# Altium project DSO_Template.PrjPCB
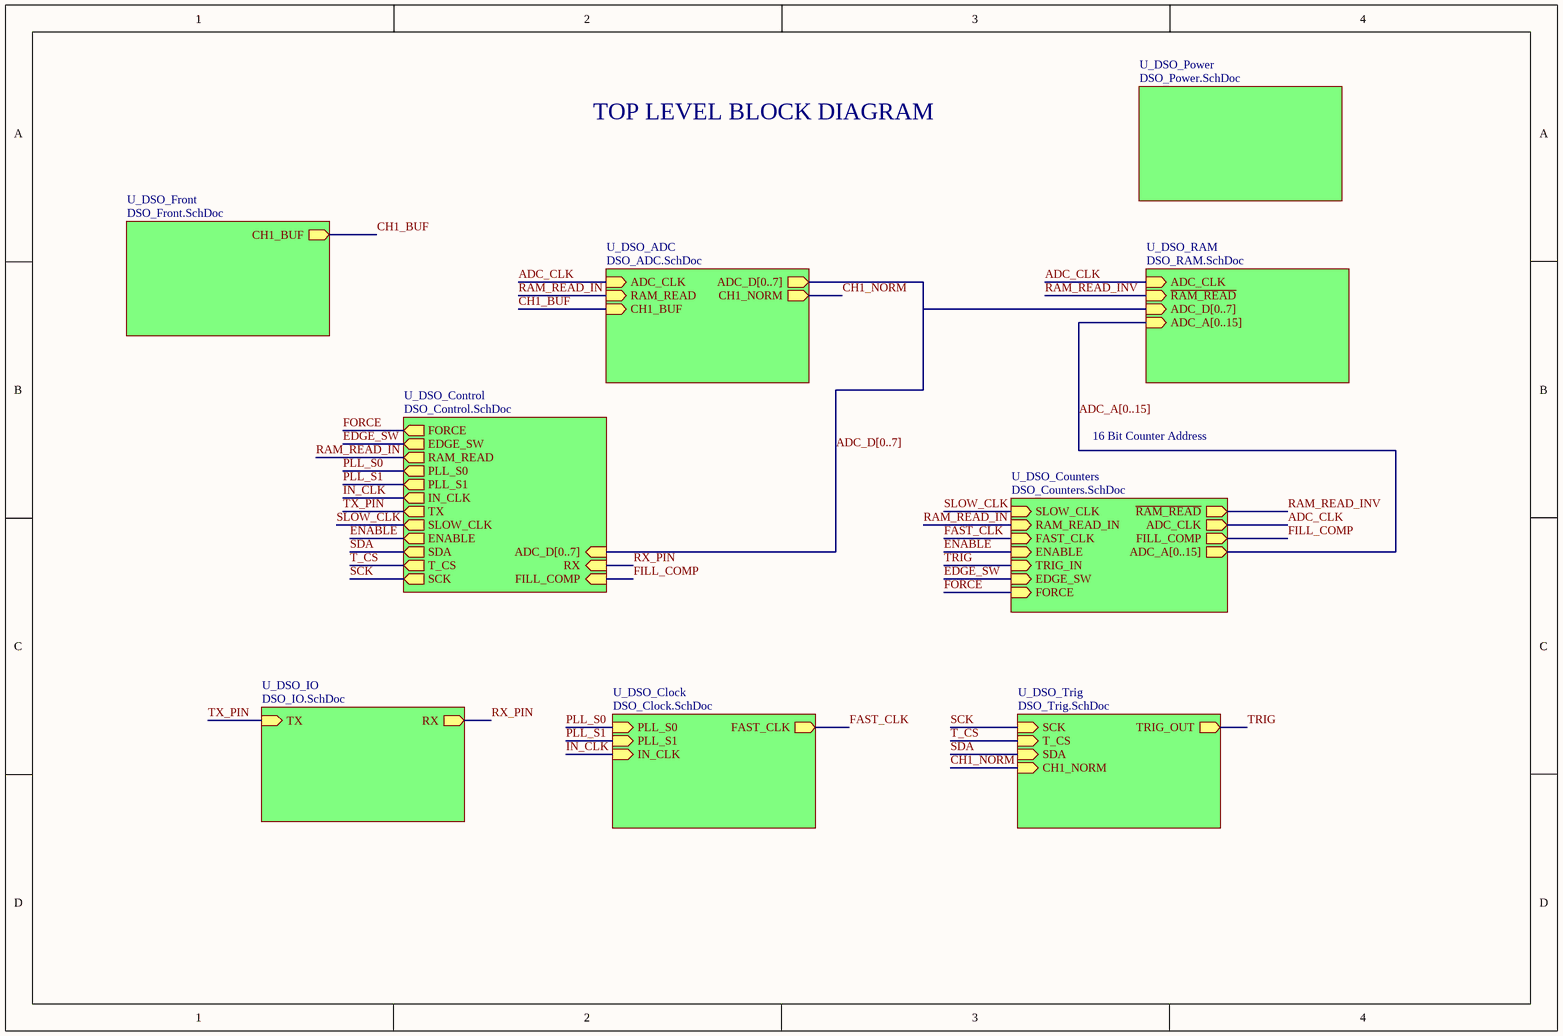
[diagram p0: DSO_Top.SchDoc]
11 sheets, 144 parts. Net scope: hierarchical (ports join the sheet entries above them; power ports are global).
Board file: DSO.PcbDoc
Sheets:
  DSO_Top.SchDoc
    U_DSO_ADC = DSO_ADC.SchDoc
    U_DSO_Clock = DSO_Clock.SchDoc
    U_DSO_Control = DSO_Control.SchDoc
    U_DSO_Counters = DSO_Counters.SchDoc
      U_DSO_CPLD = DSO_CPLD.SchDoc
    U_DSO_Front = DSO_Front.SchDoc
    U_DSO_IO = DSO_IO.SchDoc
    U_DSO_RAM = DSO_RAM.SchDoc
    U_DSO_Trig = DSO_Trig.SchDoc
    U_DSO_Power = DSO_Power.SchDoc

## Sheet DSO_Top.SchDoc: Schematic_Name
size A4; CompanyName: University of Melbourne; Engineer: Your Name Here; DocumentNumber: 1; Revision: 0.1; SheetNumber: 1; SheetTotal: 1; Title_Project: Project_Title; StudentNo: Student No.

### Sub-sheets
U_DSO_ADC = DSO_ADC.SchDoc: ADC_CLK (in), ADC_D[0..7] (out), RAM_READ (in), CH1_BUF (in), CH1_NORM (out)
U_DSO_Clock = DSO_Clock.SchDoc: FAST_CLK (out), PLL_S0 (in), PLL_S1 (in), IN_CLK (in)
U_DSO_Control = DSO_Control.SchDoc: SCK (out), T_CS (out), SDA (out), ENABLE (out), FILL_COMP (in), SLOW_CLK (out), TX (out), RX (in), IN_CLK (out), PLL_S1 (out), PLL_S0 (out), RAM_READ (out), ADC_D[0..7] (in), EDGE_SW (out), FORCE (out)
U_DSO_Counters = DSO_Counters.SchDoc: SLOW_CLK (in), ~{RAM_READ} (out), ADC_CLK (out), RAM_READ_IN (in), FAST_CLK (in), FILL_COMP (out), ENABLE (in), TRIG_IN (in), EDGE_SW (in), FORCE (in), ADC_A[0..15] (out)
U_DSO_Front = DSO_Front.SchDoc: CH1_BUF (out)
U_DSO_IO = DSO_IO.SchDoc: TX (in), RX (out)
U_DSO_Power = DSO_Power.SchDoc: no entries
U_DSO_RAM = DSO_RAM.SchDoc: ADC_CLK (in), ~{RAM_READ} (in), ADC_D[0..7] (in), ADC_A[0..15] (in)
U_DSO_Trig = DSO_Trig.SchDoc: TRIG_OUT (out), SCK (in), T_CS (in), SDA (in), CH1_NORM (in)

### Nets
ADC_CLK: sheet U_DSO_ADC/ADC_CLK, sheet U_DSO_Counters/ADC_CLK, sheet U_DSO_RAM/ADC_CLK
CH1_BUF: sheet U_DSO_ADC/CH1_BUF, sheet U_DSO_Front/CH1_BUF  [project net AA_IN]
CH1_NORM: sheet U_DSO_ADC/CH1_NORM, sheet U_DSO_Trig/CH1_NORM
EDGE_SW: sheet U_DSO_Control/EDGE_SW, sheet U_DSO_Counters/EDGE_SW
ENABLE: sheet U_DSO_Control/ENABLE, sheet U_DSO_Counters/ENABLE
FAST_CLK: sheet U_DSO_Clock/FAST_CLK, sheet U_DSO_Counters/FAST_CLK
FILL_COMP: sheet U_DSO_Control/FILL_COMP, sheet U_DSO_Counters/FILL_COMP
FORCE: sheet U_DSO_Control/FORCE, sheet U_DSO_Counters/FORCE
IN_CLK: sheet U_DSO_Clock/IN_CLK, sheet U_DSO_Control/IN_CLK
PLL_S0: sheet U_DSO_Clock/PLL_S0, sheet U_DSO_Control/PLL_S0
PLL_S1: sheet U_DSO_Clock/PLL_S1, sheet U_DSO_Control/PLL_S1
RAM_READ_IN: sheet U_DSO_ADC/RAM_READ, sheet U_DSO_Control/RAM_READ, sheet U_DSO_Counters/RAM_READ_IN  [project net RAM_READ]
RAM_READ_INV: sheet U_DSO_Counters/~{RAM_READ}, sheet U_DSO_RAM/~{RAM_READ}  [project net ~{RAM_READ}]
RX_PIN: sheet U_DSO_Control/RX, sheet U_DSO_IO/RX  [project net RX]
SCK: sheet U_DSO_Control/SCK, sheet U_DSO_Trig/SCK
SDA: sheet U_DSO_Control/SDA, sheet U_DSO_Trig/SDA
SLOW_CLK: sheet U_DSO_Control/SLOW_CLK, sheet U_DSO_Counters/SLOW_CLK
T_CS: sheet U_DSO_Control/T_CS, sheet U_DSO_Trig/T_CS
TRIG: sheet U_DSO_Counters/TRIG_IN, sheet U_DSO_Trig/TRIG_OUT
TX_PIN: sheet U_DSO_Control/TX, sheet U_DSO_IO/TX  [project net TX]

### Buses and harness runs
bus ADC_A[0..15] = sheet U_DSO_Counters/ADC_A[0..15] = sheet U_DSO_RAM/ADC_A[0..15]
bus ADC_D[0..7] = sheet U_DSO_ADC/ADC_D[0..7] = sheet U_DSO_Control/ADC_D[0..7] = sheet U_DSO_RAM/ADC_D[0..7]

### Notes on the sheet
- TOP LEVEL BLOCK DIAGRAM
- 16 Bit Counter Address

## Sheet DSO_ADC.SchDoc: Schematic_Name
size A4; CompanyName: University of Melbourne; Engineer: Your Name Here; DocumentNumber: 1; Revision: 0.1; SheetNumber: 1; SheetTotal: 1; Title_Project: Project_Title; StudentNo: Student No.
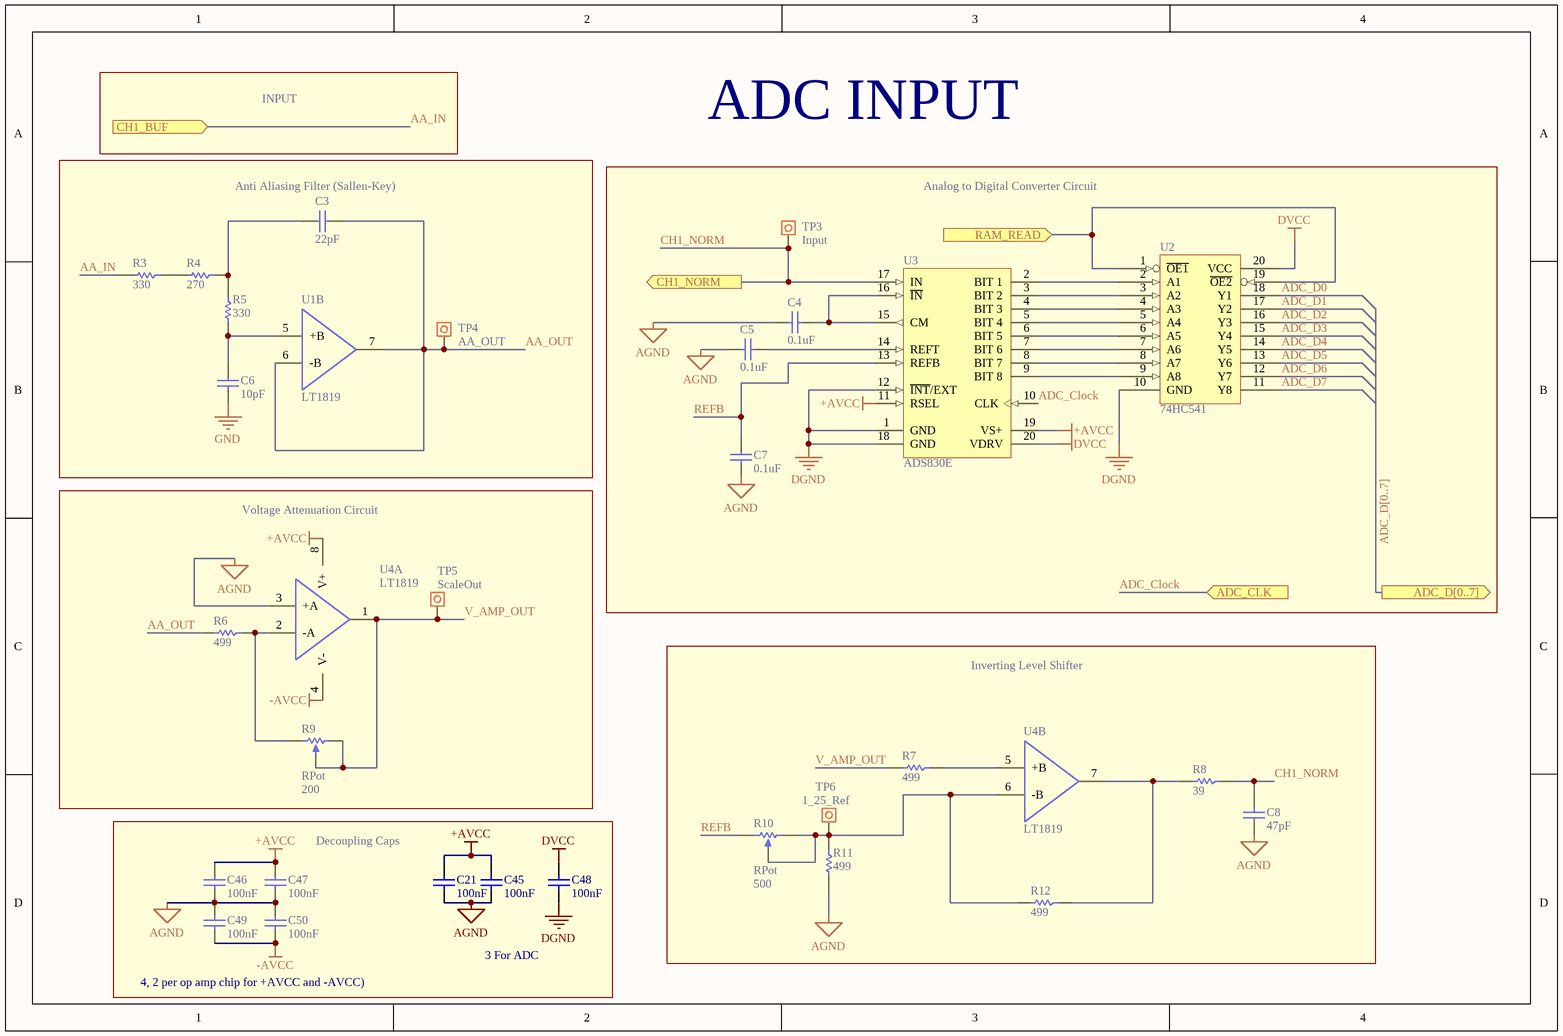
[diagram p1: DSO_ADC.SchDoc]

### Parts
C3  22pF  [0805C]
C4  0.1uF  [0805C]
C5  0.1uF  [0805C]
C6  10pF  [0805C]
C7  0.1uF  [0805C]
C8  47pF  [0805C]
C21  100nF  [0805C]
C45  100nF  [0805C]
C46  100nF  [0805C]
C47  100nF  [0805C]
C48  100nF  [0805C]
C49  100nF  [0805C]
C50  100nF  [0805C]
R3  330  [0805]
R4  270  [0805]
R5  330  [0805]
R6  499  [0805]
R7  499  [0805]
R8  39  [0805]
R9  RPot  value 200  [VR5]
R10  RPot  value 500  [VR5]
R11  499  [0805]
R12  499  [0805]
TP3  INPUT  [Testpoin]
TP4  value AA_OUT  [Testpoin]  (hidden comment: INPUT)
TP5  value ScaleOut  [Testpoin]  (hidden comment: INPUT)
TP6  value 1_25_Ref  [Testpoin]  (hidden comment: INPUT)
U1  LT1819  [SOIC-8]  (part B of 2)
U2  74HC541  [SOT163-1_N]
U3  ADS830E  [TI-DBQ20_L]
U4  LT1819  [SOIC-8]  (parts A,B of 2)

### Blocks framed on the sheet
Anti Aliasing Filter (Sallen-Key): C3 C6 R3-R5 TP4 U1
Analog to Digital Converter Circuit: C4 C5 C7 TP3 U2 U3
Voltage Attenuation Circuit: R6 R9 TP5 U4
Inverting Level Shifter: C8 R7 R8 R10-R12 TP6 U4

### Ports
ADC_CLK (in), ADC_D[0..7] (out), CH1_BUF (in), CH1_NORM (out), RAM_READ (in)

### Nets
+AVCC: C21.1 C45.1 C46.1 C47.1 U3.11(RSEL) U3.19(VS+) U4.8(V+)
-AVCC: C49.1 C50.1 U4.4(V-)
AGND: C4.1 C5.1 C7.1 C8.2 C21.2 C45.2 C46.2 C47.2 C49.2 C50.2 R11.2 U4.3(+A)
DGND: C48.2 U2.10(GND) U3.1(GND) U3.12(~{INT}/EXT) U3.18(GND)
DVCC: C48.1 U2.20(VCC) U3.20(VDRV)
GND: C6.2
AA_IN: R3.2 ; port CH1_BUF
AA_OUT: C3.1 R6.2 TP4.1 U1.6(-B) U1.7(OUTB)
ADC_Clock: U3.10(CLK) ; port ADC_CLK  [project net ADC_CLK]
ADC_D0: U2.18(Y1)
ADC_D1: U2.17(Y2)
ADC_D2: U2.16(Y3)
ADC_D3: U2.15(Y4)
ADC_D4: U2.14(Y5)
ADC_D5: U2.13(Y6)
ADC_D6: U2.12(Y7)
ADC_D7: U2.11(Y8)
CH1_NORM: C8.1 R8.1 TP3.1 U3.17(IN) ; port CH1_NORM
RAM_READ: U2.1(~{OE1}) U2.19(~{OE2}) ; port RAM_READ
REFB: C7.2 R10.1(TOP) U3.13(REFB)
V_AMP_OUT: R7.2 R9.2(TAP) R9.3(BOT) TP5.1 U4.1(OUTA)
NetC3_2: C3.2 R4.1 R5.1
NetC4_2: C4.2 U3.15(CM) U3.16(~{IN})
NetC5_2: C5.2 U3.14(REFT)
NetC6_1: C6.1 R5.2 U1.5(+B)
NetR3_1: R3.1 R4.2
NetR6_1: R6.1 R9.1(TOP) U4.2(-A)
NetR7_1: R7.1 U4.5(+B)
NetR8_2: R8.2 R12.1 U4.7(OUTB)
NetR10_2: R10.2(TAP) R10.3(BOT) R11.1 R12.2 TP6.1 U4.6(-B)
NetU2_2: U2.2(A1) U3.2(BIT_1)
NetU2_3: U2.3(A2) U3.3(BIT_2)
NetU2_4: U2.4(A3) U3.4(BIT_3)
NetU2_5: U2.5(A4) U3.5(BIT_4)
NetU2_6: U2.6(A5) U3.6(BIT_5)
NetU2_7: U2.7(A6) U3.7(BIT_6)
NetU2_8: U2.8(A7) U3.8(BIT_7)
NetU2_9: U2.9(A8) U3.9(BIT_8)

### Buses and harness runs
bus ADC_D[0..7] = port ADC_D[0..7]

### Notes on the sheet
- INPUT
- ADC INPUT
- Decoupling Caps
- 4, 2 per op amp chip for +AVCC and -AVCC)
- 3 For ADC

### Library data of the parts
C3-C8 C21 C45-C50 = C: Capacitor; Reviewed by: RM - 2018/08/05; Revision: July-2002: Re-released for DXP Platform.; Supplier 1: *; Supplier Part Number 1: *
  C3: Value: 22pF
  C4 C5 C7: Value: 0.1uF
  C6: Value: 10pF
  C8: Value: 47pF
  C21 C45-C50: Value: 100nF
R3-R8 R11 R12 = R: Resistor; Reviewed by: RM - 2018/08/05; Supplier 1: *; Suppler Part Number 1: *
  R3 R5: Value: 330
  R4: Value: 270
  R6 R7 R11 R12: Value: 499
  R8: Value: 39
R9 R10 = RPot: Potentiometer; Sim Note: Enter the Resistance value and the set point into parameter fields.; Set Position: 0.5; Published: 8-Jun-2000; LatestRevisionDate: 17-Jul-2002; LatestRevisionNote: Re-released for DXP Platform.; PackageReference: VR5; Publisher: Altium Limited; PackageDescription: Variable Resistor, Thru-Hole; 3 Leads
TP3-TP6 = Test Point: Pad
  TP3: Value: Input
U1 U4 = LT1819: OpAmp High Frequency Dual; Reviewed by: RM - 2018/08/05; Supplier 1: Digi-Key; Supplier Part Number 1: LT1819CMS8#PBF-ND
U2 = 74HC541: (ADV) Octal Buffer, Line Driver; Reviewed by: RM - 2018/08/05; Supplier 1: Digi-Key; Supplier Part Number 1: 296-1202-1-ND
U3 = ADS830E: 8-Bit, 60 MSPS ADC Single-Ended / Differential Input, Internal / External Reference and Programmble Input Range, -40 to 85 degC, 20-pin SOP (DBQ20), Green (RoHS & no Sb/Br); Reviewed by: RM - 2018/08/05; ComponentLink2URL: http://www.ti.com/general/docs/lit/getliterature.tsp?genericPartNumber=ADS830&fileType=pdf; ComponentLink2Description: Datasheet; ComponentLink1URL: http://www.ti.com/; ComponentLink3URL: http://www.ti.com/litv/pdf/mpds210a; ComponentLink3Description: Package Specification; ComponentLink1Description: Manufacturer URL; Supplier 1: Digi-Key; Supplier Part Number 1: ADS830E-ND

## Sheet DSO_Clock.SchDoc: Schematic_Name
size A4; CompanyName: University of Melbourne; Engineer: Your Name Here; DocumentNumber: 1; Revision: 0.1; SheetNumber: 1; SheetTotal: 1; Title_Project: Project_Title; StudentNo: Student No.
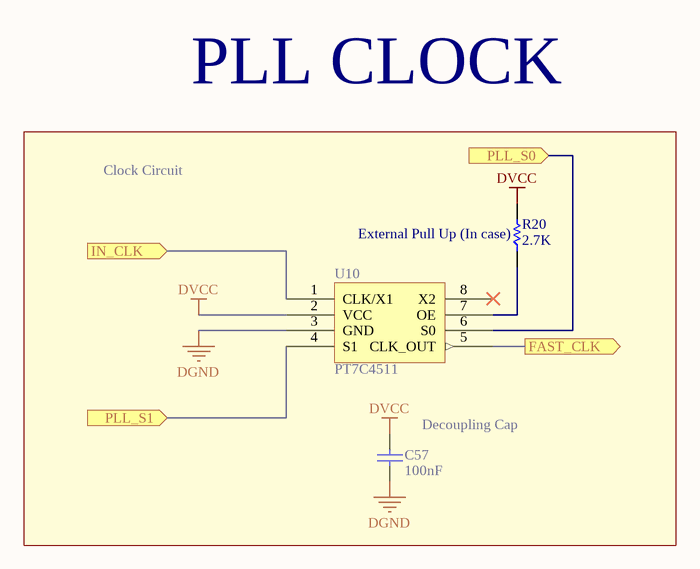
[diagram p2: DSO_Clock.SchDoc]

### Parts
C57  100nF  [0805C]
R20  2.7K  [0805]
U10  PT7C4511  [SOIC-8]

### Ports
FAST_CLK (out), IN_CLK (in), PLL_S0 (in), PLL_S1 (in)

### Nets
DGND: C57.2 U10.3(GND)
DVCC: C57.1 R20.2 U10.2(VCC)
FAST_CLK: U10.5(CLK_OUT) ; port FAST_CLK
IN_CLK: U10.1(CLK/X1) ; port IN_CLK
PLL_S0: U10.6(S0) ; port PLL_S0
PLL_S1: U10.4(S1) ; port PLL_S1
NetR20_1: R20.1 U10.7(OE)

Not connected (* = marked no-connect by the designer): U10 8(X2)*

### Notes on the sheet
- PLL CLOCK
- Clock Circuit
- (near R20) External Pull Up (In case)
- (near C57) Decoupling Cap

### Library data of the parts
C57 = C: Capacitor; Reviewed by: RM - 2018/08/05; Revision: July-2002: Re-released for DXP Platform.; Supplier 1: *; Supplier Part Number 1: *; Value: 100nF
R20 = R: Resistor; Reviewed by: RM - 2018/08/05; Supplier 1: *; Suppler Part Number 1: *; Value: 2.7K
U10 = PT7C4511: PLL Clock Multiplier; Reviewed by: RM - 2018/08/05; Supplier 1: Digi-Key; Supplier Part Number 1: PT7C4511WEXDICT-ND

## Sheet DSO_Control.SchDoc: Schematic_Name
size A4; CompanyName: University of Melbourne; Engineer: Your Name Here; DocumentNumber: 1; Revision: 0.1; SheetNumber: 1; SheetTotal: 1; Title_Project: Project_Title; StudentNo: Student No.
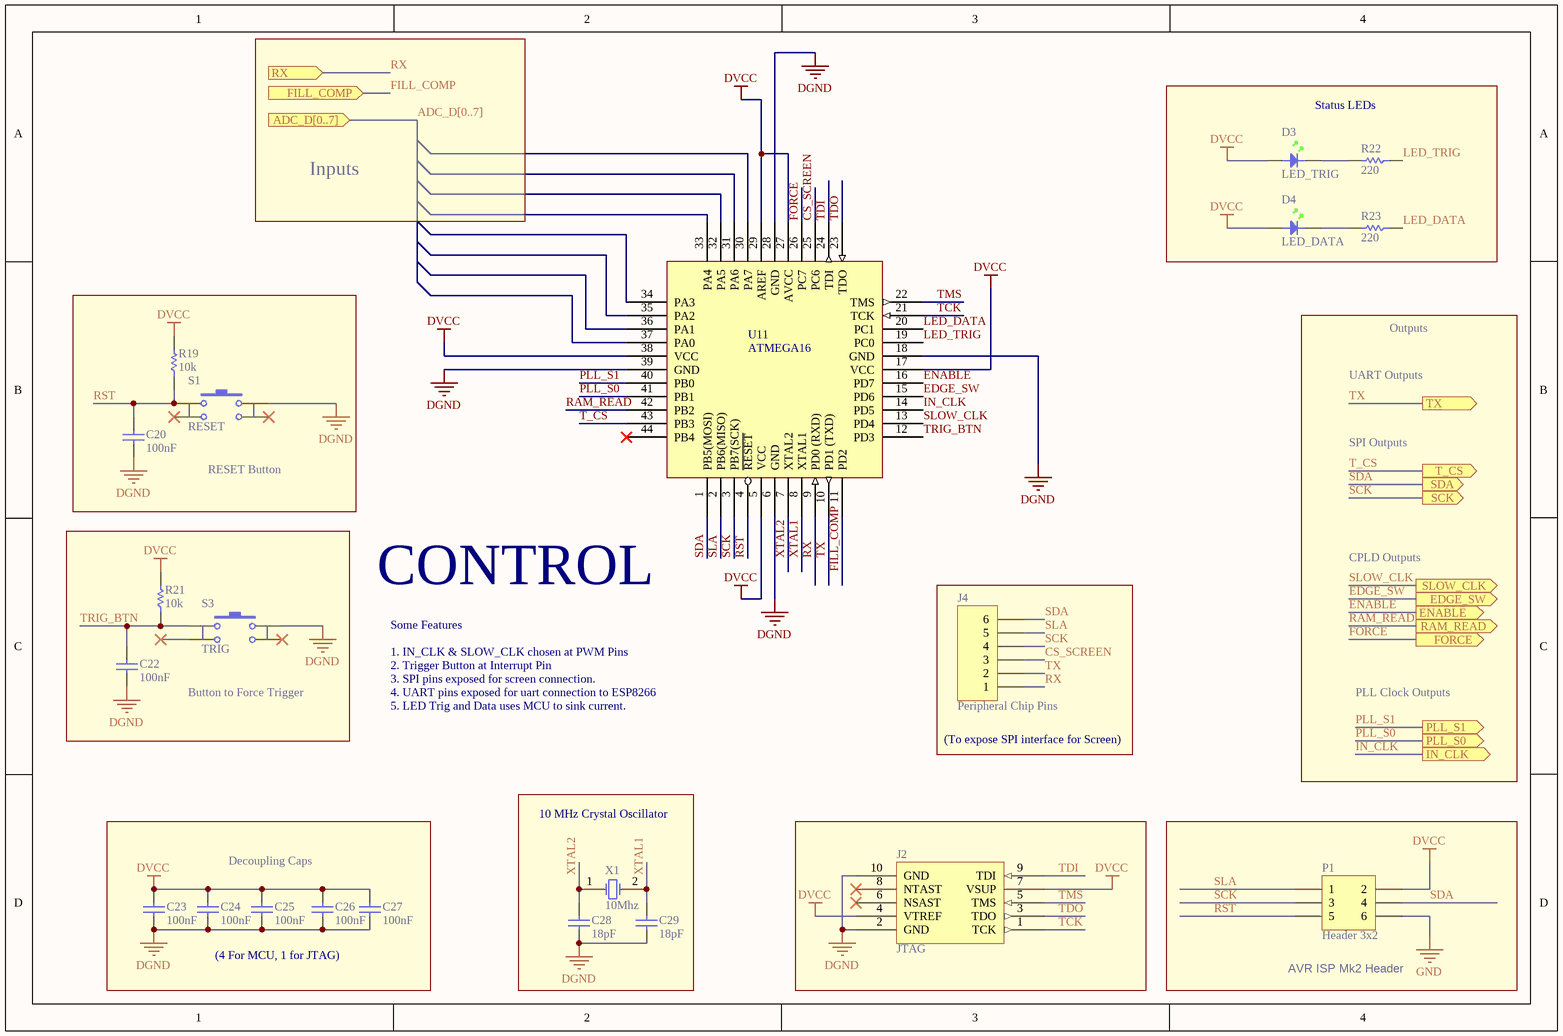
[diagram p3: DSO_Control.SchDoc]

### Parts
C20  100nF  [0805C]
C22  100nF  [0805C]
C23  100nF  [0805C]
C24  100nF  [0805C]
C25  100nF  [0805C]
C26  100nF  [0805C]
C27  100nF  [0805C]
C28  18pF  [0805C]
C29  18pF  [0805C]
D3  LED_TRIG  [0805D-GREEN]
D4  LED_DATA  [0805D-GREEN]
J2  JTAG  [BOXEDVERT10]
J4  Peripheral Chip Pins  [HDR1X6]
P1  Header 3x2  [HDR3x2]
R19  10k  [0805]
R21  10k  [0805]
R22  220  [0805]
R23  220  [0805]
S1  RESET  [SPST PB SWITCH SMD]
S3  TRIG  [SPST PB SWITCH SMD]
U11  ATMEGA16  [QFP-48]
X1  10Mhz  [XTAL_FLAT_SMD]

### Blocks framed on the sheet
Status LEDs: D3 D4 R22 R23
RESET Button: C20 R19 S1
Button to Force Trigger: C22 R21 S3
(To expose SPI interface for Screen): J4
10 MHz Crystal Oscillator: C28 C29 X1
AVR ISP Mk2 Header: P1

### Ports
ADC_D[0..7] (in), EDGE_SW (out), ENABLE (out), FILL_COMP (in), FORCE (out), IN_CLK (out), PLL_S0 (out), PLL_S1 (out), RAM_READ (out), RX (in), SCK (out), SDA (out), SLOW_CLK (out), T_CS (out), TX (out)

### Nets
DGND: C20.2 C22.2 C23.2 C24.2 C25.2 C26.2 C27.2 C28.2 C29.2 J2.2(GND) J2.10(GND) S1.2 S3.2 U11.6(GND) U11.18(GND) U11.28(GND) U11.39(GND)
DVCC: C23.1 C24.1 C25.1 C26.1 C27.1 D3.A D4.A J2.4(VTREF) J2.7(VSUP) P1.2 R19.2 R21.2 U11.5(VCC) U11.17(VCC) U11.27(AVCC) U11.29(AREF) U11.38(VCC)
GND: P1.6
CS_SCREEN: J4.3 U11.25(PC6)
EDGE_SW: U11.15(PD6) ; port EDGE_SW
ENABLE: U11.16(PD7) ; port ENABLE
FILL_COMP: U11.11(PD2) ; port FILL_COMP
FORCE: U11.26(PC7) ; port FORCE
IN_CLK: U11.14(PD5) ; port IN_CLK
LED_DATA: R23.1 U11.20(PC1)
LED_TRIG: R22.1 U11.19(PC0)
PLL_S0: U11.41(PB1) ; port PLL_S0
PLL_S1: U11.40(PB0) ; port PLL_S1
RAM_READ: U11.42(PB2) ; port RAM_READ
RST: C20.1 P1.5 R19.1 S1.1 U11.4(~{RESET})
RX: J4.1 U11.9(PD0_(RXD)) ; port RX
SCK: J4.4 P1.3 U11.3(PB7(SCK)) ; port SCK
SDA: J4.6 P1.4 U11.1(PB5(MOSI)) ; port SDA
SLA: J4.5 P1.1 U11.2(PB6(MISO))
SLOW_CLK: U11.13(PD4) ; port SLOW_CLK
T_CS: U11.43(PB3) ; port T_CS
TCK: J2.1(TCK) U11.21(TCK)
TDI: J2.9(TDI) U11.24(TDI)
TDO: J2.3(TDO) U11.23(TDO)
TMS: J2.5(TMS) U11.22(TMS)
TRIG_BTN: C22.1 R21.1 S3.1 U11.12(PD3)
TX: J4.2 U11.10(PD1_(TXD)) ; port TX
XTAL1: C29.1 U11.8(XTAL1) X1.2(OSC2)
XTAL2: C28.1 U11.7(XTAL2) X1.1(OSC1)
NetD3_K: D3.K R22.2
NetD4_K: D4.K R23.2

Not connected (* = marked no-connect by the designer): J2 6(NSAST)* 8(NTAST)*; S1 3* 4*; S3 3* 4*; U11 30(PA7) 31(PA6) 32(PA5) 33(PA4) 34(PA3) 35(PA2) 36(PA1) 37(PA0) 44(PB4)*

### Buses and harness runs
bus ADC_D[0..7] = port ADC_D[0..7]

### Notes on the sheet
- Inputs
- UART Outputs
- Outputs
- SPI Outputs
- CPLD Outputs
- CONTROL
- 1. IN_CLK & SLOW_CLK chosen at PWM Pins
- Some Features
- 2. Trigger Button at Interrupt Pin
- 3. SPI pins exposed for screen connection.
- 4. UART pins exposed for uart connection to ESP8266
- 5. LED Trig and Data uses MCU to sink current.
- PLL Clock Outputs
- Decoupling Caps
- (4 For MCU, 1 for JTAG)

### Library data of the parts
C20 C22-C29 = C: Capacitor; Reviewed by: RM - 2018/08/05; Revision: July-2002: Re-released for DXP Platform.; Supplier 1: *; Supplier Part Number 1: *
  C20 C22-C27: Value: 100nF
  C28 C29: Value: 18pF
D3 D4 = LED GREEN: Light Emitting Diode; Reviewed by: RM - 2018/08/05; Revision: July-2002: Re-released for DXP Platform.; Supplier 1: Digi-Key; Supplier Part Number 1: 160-1423-1-ND
J2 = JTAG_CON: Reviewed by: RM - 2018/08/05; Supplier 1: Digi-Key; Supplier Part Number 1: OR896-ND
J4 = Header 6: Header, 6-Pin
P1 = Header 3x2: Header, 5-Pin; Reviewed by: RM - 2018/08/05; Supplier 1: Digi-Key; Supplier Part Number 1: 952-2121-ND
R19 R21-R23 = R: Resistor; Reviewed by: RM - 2018/08/05; Supplier 1: *; Suppler Part Number 1: *
  R19 R21: Value: 10k
  R22 R23: Value: 220
S1 S3 = SW_PB_1P1T4: Momentary Push Button Switch 1P 1T 2pins; Reviewed by: RM - 2018/08/05; Revision: July-2002: Re-released for DXP Platform.; Supplier 1: Digi-Key; Supplier Part Number 1: CKN9085CT-ND
U11 = ATMEGA16: ATMEGA16 Microcontroller; Reviewed by: RM - 2018/08/05; Supplier 1: Digi-Key; Supplier Part Number 1: ATMEGA16A-AU-ND
X1 = XTAL: Crystal Oscillator; Reviewed by: RM - 2018/08/05; Revision: July-2002: Re-released for DXP Platform.; Supplier 1: Digi-Key; Supplier Part Number 1: 887-1080-1-ND

## Sheet DSO_Counters.SchDoc: Schematic_Name
size A4; CompanyName: University of Melbourne; DrawnBy: Student_#; Engineer: Your Name Here; Organization: University of Melbourne; DocumentNumber: 5; Revision: 0.1; SheetNumber: 5; SheetTotal: 10; Title_Project: Project_Title
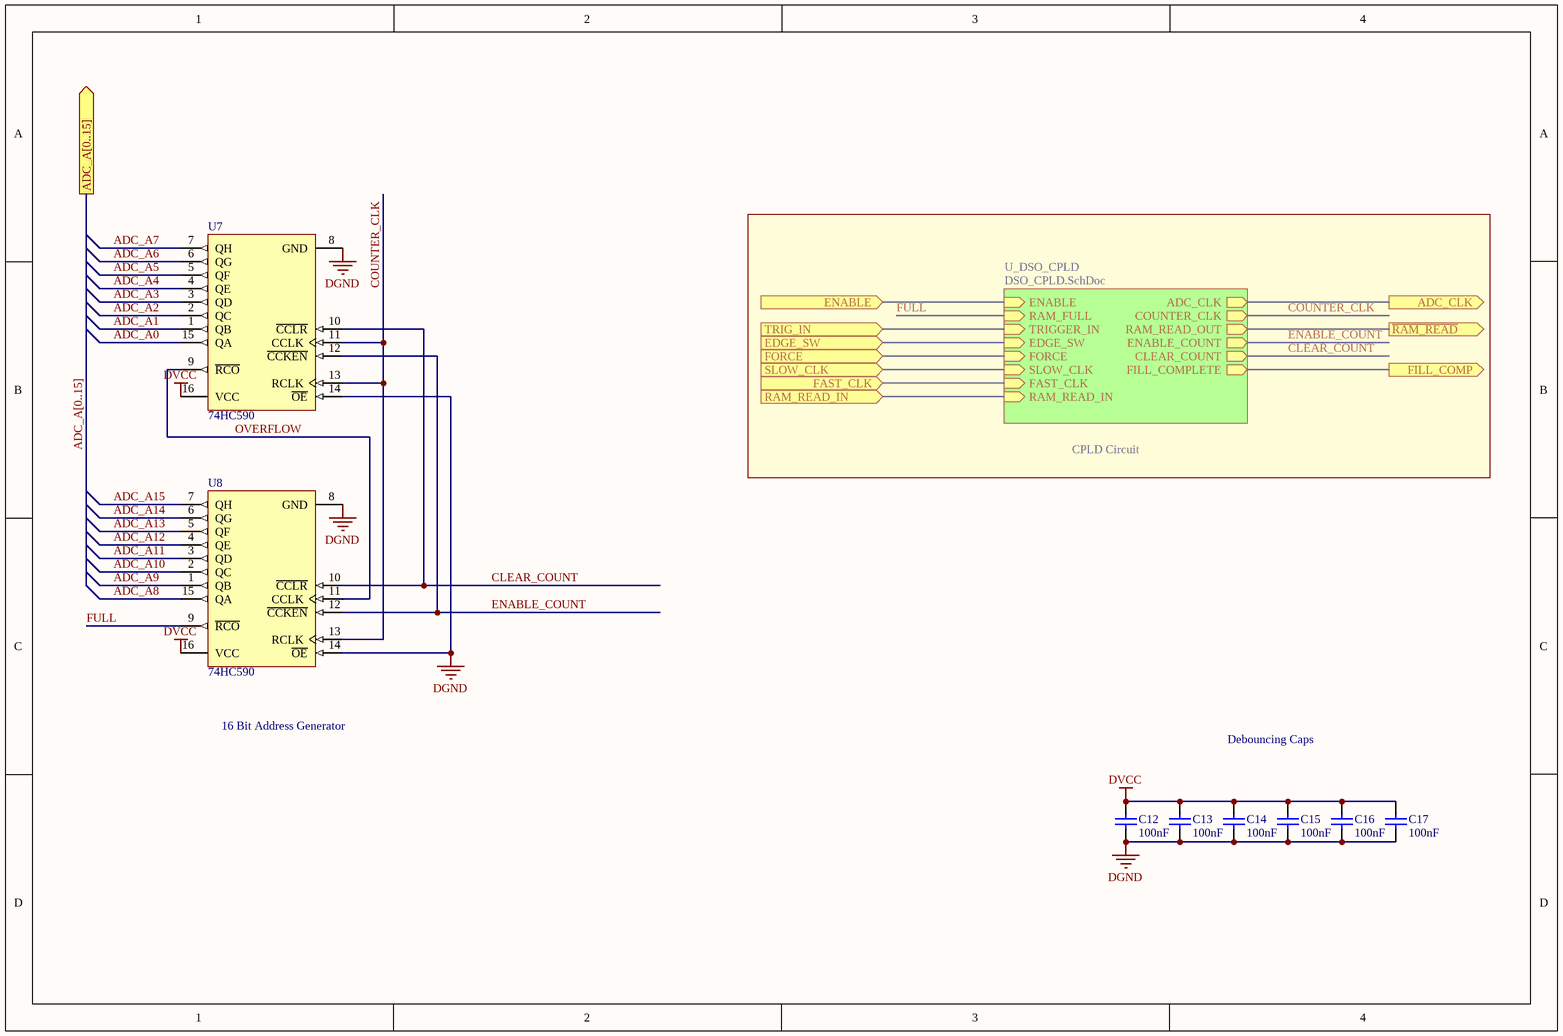
[diagram p4: DSO_Counters.SchDoc]

### Parts
C12  100nF  [0805C]
C13  100nF  [0805C]
C14  100nF  [0805C]
C15  100nF  [0805C]
C16  100nF  [0805C]
C17  100nF  [0805C]
U7  74HC590  [SOIC-16]
U8  74HC590  [SOIC-16]

### Sub-sheets
U_DSO_CPLD = DSO_CPLD.SchDoc: ENABLE (in), RAM_FULL (in), TRIGGER_IN (in), EDGE_SW (in), FORCE (in), SLOW_CLK (in), FAST_CLK (in), RAM_READ_IN (in), ADC_CLK (out), COUNTER_CLK (out), RAM_READ_OUT (out), ENABLE_COUNT (out), CLEAR_COUNT (out), FILL_COMPLETE (out)

### Ports
ADC_A[0..15] (out), ADC_CLK (out), EDGE_SW (in), ENABLE (in), FAST_CLK (in), FILL_COMP (out), FORCE (in), RAM_READ_IN (in), SLOW_CLK (in), TRIG_IN (in), ~{RAM_READ} (out)

### Nets
DGND: C12.2 C13.2 C14.2 C15.2 C16.2 C17.2 U7.8(GND) U7.14(~{OE}) U8.8(GND) U8.14(~{OE})
DVCC: C12.1 C13.1 C14.1 C15.1 C16.1 C17.1 U7.16(VCC) U8.16(VCC)
ADC_A0: U7.15(QA)
ADC_A1: U7.1(QB)
ADC_A2: U7.2(QC)
ADC_A3: U7.3(QD)
ADC_A4: U7.4(QE)
ADC_A5: U7.5(QF)
ADC_A6: U7.6(QG)
ADC_A7: U7.7(QH)
ADC_A8: U8.15(QA)
ADC_A9: U8.1(QB)
ADC_A10: U8.2(QC)
ADC_A11: U8.3(QD)
ADC_A12: U8.4(QE)
ADC_A13: U8.5(QF)
ADC_A14: U8.6(QG)
ADC_A15: U8.7(QH)
ADC_CLK: port ADC_CLK, sheet U_DSO_CPLD/ADC_CLK
CLEAR_COUNT: U7.10(~{CCLR}) U8.10(~{CCLR}) ; sheet U_DSO_CPLD/CLEAR_COUNT
COUNTER_CLK: U7.11(CCLK) U7.13(RCLK) U8.13(RCLK) ; sheet U_DSO_CPLD/COUNTER_CLK
EDGE_SW: port EDGE_SW, sheet U_DSO_CPLD/EDGE_SW
ENABLE: port ENABLE, sheet U_DSO_CPLD/ENABLE
ENABLE_COUNT: U7.12(~{CCKEN}) U8.12(~{CCKEN}) ; sheet U_DSO_CPLD/ENABLE_COUNT
FAST_CLK: port FAST_CLK, sheet U_DSO_CPLD/FAST_CLK
FILL_COMP: port FILL_COMP, sheet U_DSO_CPLD/FILL_COMPLETE
FORCE: port FORCE, sheet U_DSO_CPLD/FORCE
FULL: U8.9(~{RCO}) ; sheet U_DSO_CPLD/RAM_FULL
OVERFLOW: U7.9(~{RCO}) U8.11(CCLK)
~{RAM_READ}: port ~{RAM_READ}, sheet U_DSO_CPLD/RAM_READ_OUT
RAM_READ: port RAM_READ_IN, sheet U_DSO_CPLD/RAM_READ_IN
SLOW_CLK: port SLOW_CLK, sheet U_DSO_CPLD/SLOW_CLK
TRIG: port TRIG_IN, sheet U_DSO_CPLD/TRIGGER_IN

### Buses and harness runs
bus ADC_A[0..15] = port ADC_A[0..15]

### Notes on the sheet
- CPLD Circuit
- 16 Bit Address Generator
- Debouncing Caps

### Library data of the parts
C12-C17 = C: Capacitor; Reviewed by: RM - 2018/08/05; Revision: July-2002: Re-released for DXP Platform.; Value: 100nF; Supplier 1: *; Supplier Part Number 1: *
U7 U8 = 74HC590: 8-Bit Binary Counter Register; Reviewed by: RM - 2018/08/05; ComponentLink1Description: Manufacturer Link; ComponentLink1URL: http://www.st.com/; ComponentLink2Description: Datasheet; ComponentLink2URL: http://www.st.com/stonline/products/literature/ds/1986/m74hc590.pdf; Supplier 1: Digi-Key; Supplier Part Number 1: 296-17132-1-ND

## Sheet DSO_CPLD.SchDoc
size A4
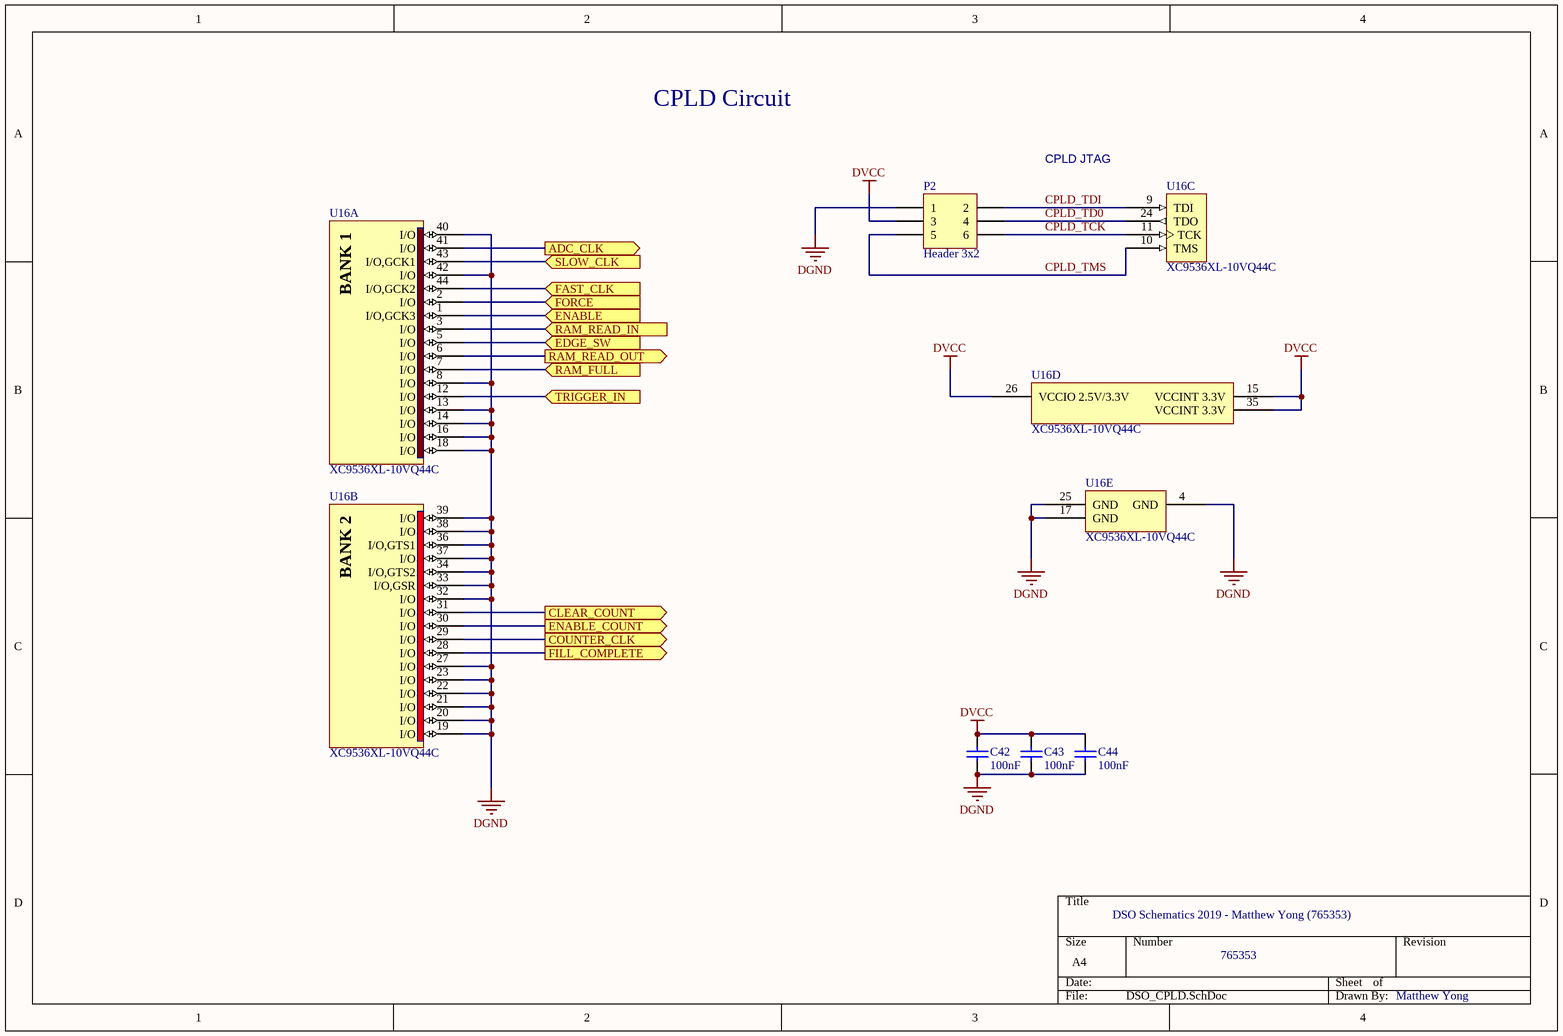
[diagram p5: DSO_CPLD.SchDoc]

### Parts
C42  100nF  [0805C]
C43  100nF  [0805C]
C44  100nF  [0805C]
P2  Header 3x2  [HDR3x2]
U16  XC9536XL-10VQ44C  [VQ44_L]  (parts A,B,C,D,E of 5)

### Ports
ADC_CLK (out), CLEAR_COUNT (out), COUNTER_CLK (out), EDGE_SW (in), ENABLE (in), ENABLE_COUNT (out), FAST_CLK (in), FILL_COMPLETE (out), FORCE (in), RAM_FULL (in), RAM_READ_IN (in), RAM_READ_OUT (out), SLOW_CLK (in), TRIGGER_IN (in)

### Nets
DGND: C42.2 C43.2 C44.2 P2.1 U16.4(GND) U16.8(I/O) U16.13(I/O) U16.14(I/O) U16.16(I/O) U16.17(GND) U16.18(I/O) U16.19(I/O) U16.20(I/O) U16.21(I/O) U16.22(I/O) U16.23(I/O) U16.25(GND) U16.27(I/O) U16.32(I/O) U16.33(I/O,GSR) U16.34(I/O,GTS2) U16.36(I/O,GTS1) U16.37(I/O) U16.38(I/O) U16.39(I/O) U16.40(I/O) U16.42(I/O)
DVCC: C42.1 C43.1 C44.1 P2.3 U16.15(VCCINT_3.3V) U16.26(VCCIO_2.5V/3.3V) U16.35(VCCINT_3.3V)
ADC_CLK: U16.41(I/O) ; port ADC_CLK
CLEAR_COUNT: U16.31(I/O) ; port CLEAR_COUNT
COUNTER_CLK: U16.29(I/O) ; port COUNTER_CLK
CPLD_TCK: P2.6 U16.11(TCK)
CPLD_TD0: P2.4 U16.24(TDO)
CPLD_TDI: P2.2 U16.9(TDI)
CPLD_TMS: P2.5 U16.10(TMS)
EDGE_SW: U16.5(I/O) ; port EDGE_SW
ENABLE: U16.1(I/O,GCK3) ; port ENABLE
ENABLE_COUNT: U16.30(I/O) ; port ENABLE_COUNT
FAST_CLK: U16.44(I/O,GCK2) ; port FAST_CLK
FILL_COMP: U16.28(I/O) ; port FILL_COMPLETE
FORCE: U16.2(I/O) ; port FORCE
FULL: U16.7(I/O) ; port RAM_FULL
~{RAM_READ}: U16.6(I/O) ; port RAM_READ_OUT
RAM_READ: U16.3(I/O) ; port RAM_READ_IN
SLOW_CLK: U16.43(I/O,GCK1) ; port SLOW_CLK
TRIG: U16.12(I/O) ; port TRIGGER_IN

### Notes on the sheet
- CPLD Circuit
- CPLD JTAG
- DSO Schematics 2019 - Matthew Yong (765353)
- 765353
- Matthew Yong
- (in symbol XC9536XL-10VQG44C, part A) BANK 1
- (in symbol XC9536XL-10VQG44C, part B) BANK 2

### Library data of the parts
C42-C44 = C: Capacitor; Reviewed by: RM - 2018/08/05; Revision: July-2002: Re-released for DXP Platform.; Value: 100nF; Supplier 1: *; Supplier Part Number 1: *
P2 = Header 3x2: as P1 on sheet DSO_Control; Supplier 1: Digi-Key; Supplier Part Number 1: 952-2121-ND
U16 = XC9536XL-10VQG44C: FastFLASH XC900XL, 3.3V High-Performance 36 Macrocell CPLD, 34 User I/Os, 44-Pin VQFP, Speed Grade 10, Commercial Grade; Reviewed by: RM - 2018/08/05; Supplier 1: Digi-Key; Supplier Part Number 1: 122-1385-ND

## Sheet DSO_Front.SchDoc: Schematic_Name
size A4; CompanyName: University of Melbourne; Engineer: Your Name Here; DocumentNumber: 1; Revision: 0.1; SheetNumber: 1; SheetTotal: 1; Title_Project: Project_Title; StudentNo: Student No.
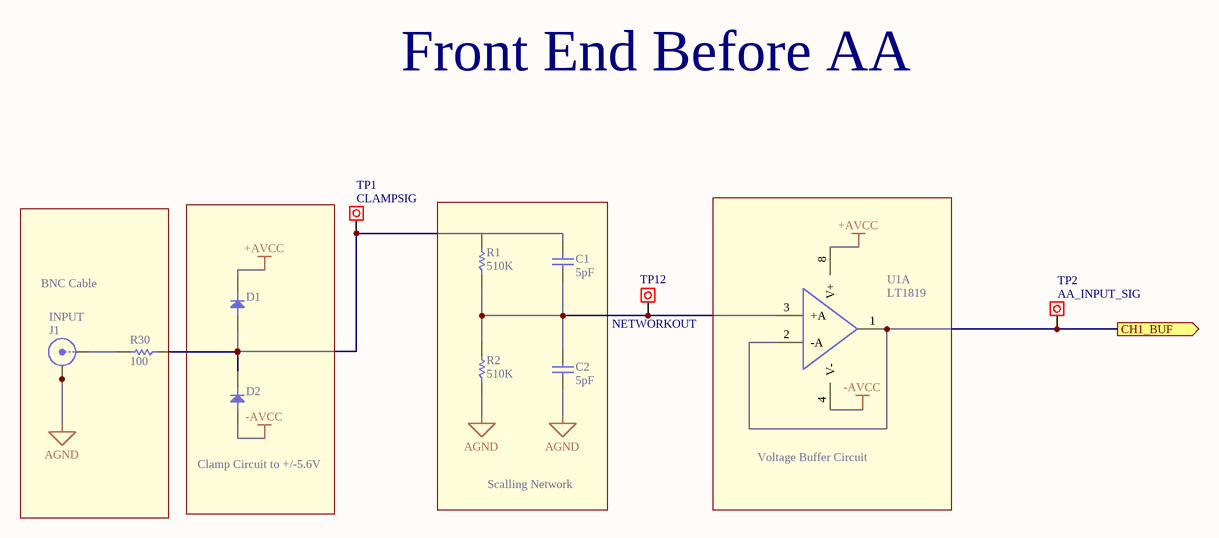
[diagram p6: DSO_Front.SchDoc]

### Parts
C1  5pF  [0805C]
C2  5pF  [0805C]
D1  Diode  [SOD-123]  (value not drawn)
D2  Diode  [SOD-123]  (value not drawn)
J1  INPUT  [BNC_VERT]
R1  510K  [0805]
R2  510K  [0805]
R30  100  [0805]
TP1  value CLAMPSIG  [Testpoin]  (hidden comment: INPUT)
TP2  value AA_INPUT_SIG  [Testpoin]  (hidden comment: INPUT)
TP12  value NETWORKOUT  [Testpoin]  (hidden comment: INPUT)
U1  LT1819  [SOIC-8]  (part A of 2)

### Blocks framed on the sheet
BNC Cable: J1 R30
Clamp Circuit to +/-5.6V: D1 D2
Scalling Network: C1 C2 R1 R2
Voltage Buffer Circuit: U1

### Ports
CH1_BUF (out)

### Nets
+AVCC: D1.K U1.8(V+)
-AVCC: D2.A U1.4(V-)
AGND: C2.2 J1.2(Y) J1.3(Y) J1.4(Y) J1.5(Y) R2.1
AA_IN: TP2.1 U1.1(OUTA) U1.2(-A) ; port CH1_BUF
NetC1_1: C1.1 D1.A D2.K R30.1 TP1.1
NetC1_2: C1.2 C2.1 R1.1 R2.2 TP12.1 U1.3(+A)
NetJ1_1: J1.1(X) R30.2

Not connected (* = marked no-connect by the designer): R1 2

### Notes on the sheet
- Front End Before AA

### Library data of the parts
C1 C2 = C: Capacitor; Reviewed by: RM - 2018/08/05; Revision: July-2002: Re-released for DXP Platform.; Supplier 1: *; Supplier Part Number 1: *; Value: 5pF
D1 D2 = D: Reviewed by: RM - 2018/08/05; Revision: July-2002: Re-released for DXP Platform.; Supplier 1: *; Supplier Part Number 1: *
J1 = BNC: BNC Straight; Reviewed by: RM - 2018/08/05; Supplier Part Number 1: A97581-ND; Supplier 1: Digi-Key
R1 R2 R30 = R: Resistor; Reviewed by: RM - 2018/08/05; Supplier 1: *; Suppler Part Number 1: *
  R1 R2: Value: 510K
  R30: Value: 100
TP1 TP2 TP12 = Test Point: Pad
U1 = LT1819: as U1 on sheet DSO_ADC; Supplier 1: Digi-Key; Supplier Part Number 1: LT1819CMS8#PBF-ND

## Sheet DSO_IO.SchDoc: Schematic_Name
size A4; CompanyName: University of Melbourne; Engineer: Your Name Here; DocumentNumber: 1; Revision: 0.1; SheetNumber: 1; SheetTotal: 1; Title_Project: Project_Title; StudentNo: Student No.
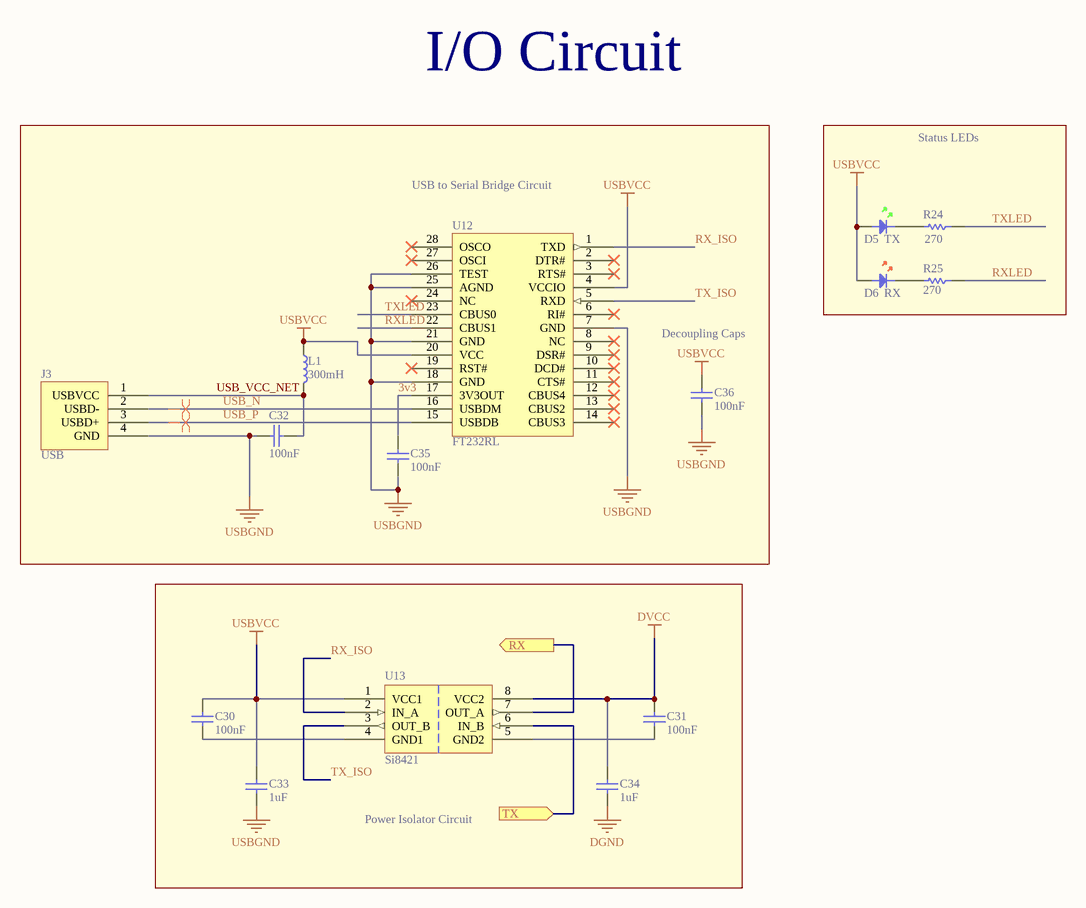
[diagram p7: DSO_IO.SchDoc]

### Parts
C30  100nF  [0805C]
C31  100nF  [0805C]
C32  100nF  [0805C]
C33  1uF  [0805C]
C34  1uF  [0805C]
C35  100nF  [0805C]
C36  100nF  [0805C]
D5  TX  [0805D-GREEN]
D6  RX  [0805D-RED]
J3  USB  [USBPLUG]
L1  300mH  [0805]
R24  270  [0805]
R25  270  [0805]
U12  FT232RL  [SSOP-28]
U13  Si8421  [SOIC-8]

### Blocks framed on the sheet
Status LEDs: D5 D6 R24 R25
Power Isolator Circuit: C30 C31 C33 C34 U13

### Ports
RX (out), TX (in)

### Nets
DGND: C34.1
DVCC: C31.1 C34.2 U13.8(VCC2)
USBGND: C32.2 C33.2 C35.2 C36.2 J3.4(GND) U12.7(GND) U12.18(GND) U12.21(GND) U12.25(AGND) U12.26(TEST)
USBVCC: C30.1 C33.1 C36.1 D5.A D6.A L1.1 U12.4(VCCIO) U12.20(VCC) U13.1(VCC1)
3v3: C35.1 U12.17(3V3OUT)
RX: U13.7(OUT_A) ; port RX
RX_ISO: U12.1(TXD) U13.2(IN_A)
RXLED: R25.1 U12.22(CBUS1)
TX: U13.6(IN_B) ; port TX
TX_ISO: U12.5(RXD) U13.3(OUT_B)
TXLED: R24.1 U12.23(CBUS0)
USB_N: J3.2(USBD-) U12.16(USBDM)
USB_P: J3.3(USBD+) U12.15(USBDB)
USB_VCC_NET: C32.1 J3.1(USBVCC) L1.2
NetC30_2: C30.2 U13.4(GND1)
NetC31_2: C31.2 U13.5(GND2)
NetD5_K: D5.K R24.2
NetD6_K: D6.K R25.2

Not connected (* = marked no-connect by the designer): U12 2(DTR#)* 3(RTS#)* 6(RI#)* 8(NC)* 9(DSR#)* 10(DCD#)* 11(CTS#)* 12(CBUS4)* 13(CBUS2)* 14(CBUS3)* 19(RST#)* 24(NC)* 27(OSCI)* 28(OSCO)*

### Layout directives
differential pair: USB_N, USB_P

### Notes on the sheet
- I/O Circuit
- USB to Serial Bridge Circuit
- (near C36) Decoupling Caps

### Library data of the parts
C30-C36 = C: Capacitor; Reviewed by: RM - 2018/08/05; Revision: July-2002: Re-released for DXP Platform.; Supplier 1: *; Supplier Part Number 1: *
  C30-C32 C35 C36: Value: 100nF
  C33 C34: Value: 1uF
D5 = LED GREEN: as D3 on sheet DSO_Control; Revision: July-2002: Re-released for DXP Platform.; Supplier 1: Digi-Key; Supplier Part Number 1: 160-1423-1-ND
D6 = LED RED: Light Emitting Diode; Reviewed by: RM - 2018/08/05; Revision: July-2002: Re-released for DXP Platform.; Supplier 1: Digi-Key; Supplier Part Number 1: 475-1415-1-ND
J3 = USBPLUG: USB B Type Connector; Reviewed by: RM - 2018/08/05; Supplier 1: Digi-Key; Supplier Part Number 1: 609-1039-ND
L1 = I: Inductor; Reviewed by: RM - 2018/08/05; Value: 300mH; Supplier 1: *; Supplier Part Number 1: *
R24 R25 = R: Resistor; Reviewed by: RM - 2018/08/05; Value: 270; Supplier 1: *; Suppler Part Number 1: *
U12 = FT232RL: USB to Serial bridge; Reviewed by: RM - 2018/08/05; Supplier 1: Digi-Key; Supplier Part Number 1: 768-1007-1-ND
U13 = Si8421: Dual Channel Digital Isolator Both Ways; Reviewed by: RM - 2018/08/05; Supplier 1: Digi-Key; Supplier Part Number 1: 336-1755-5-ND

## Sheet DSO_RAM.SchDoc: Schematic_Name
size A4; CompanyName: University of Melbourne; Engineer: Your Name Here; DocumentNumber: 1; Revision: 0.1; SheetNumber: 1; SheetTotal: 1; Title_Project: Project_Title; StudentNo: Student No.
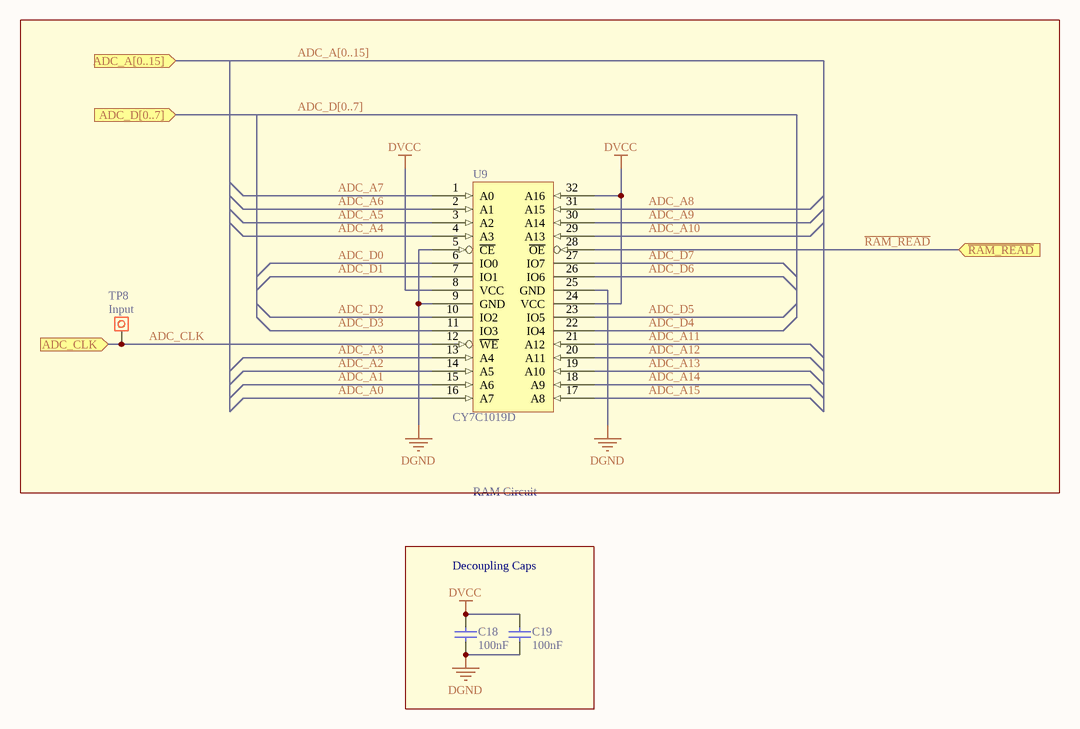
[diagram p8: DSO_RAM.SchDoc]

### Parts
C18  100nF  [0805C]
C19  100nF  [0805C]
TP8  INPUT  [Testpoin]
U9  CY7C1019D  [TSOP-32]

### Blocks framed on the sheet
Decoupling Caps: C18 C19

### Ports
ADC_A[0..15] (in), ADC_CLK (in), ADC_D[0..7] (in), ~{RAM_READ} (in)

### Nets
DGND: C18.2 C19.2 U9.5(~{CE}) U9.9(GND) U9.25(GND)
DVCC: C18.1 C19.1 U9.8(VCC) U9.24(VCC) U9.32(A16)
ADC_A0: U9.16(A7)
ADC_A1: U9.15(A6)
ADC_A2: U9.14(A5)
ADC_A3: U9.13(A4)
ADC_A4: U9.4(A3)
ADC_A5: U9.3(A2)
ADC_A6: U9.2(A1)
ADC_A7: U9.1(A0)
ADC_A8: U9.31(A15)
ADC_A9: U9.30(A14)
ADC_A10: U9.29(A13)
ADC_A11: U9.21(A12)
ADC_A12: U9.20(A11)
ADC_A13: U9.19(A10)
ADC_A14: U9.18(A9)
ADC_A15: U9.17(A8)
ADC_CLK: TP8.1 U9.12(~{WE}) ; port ADC_CLK
ADC_D0: U9.6(IO0)
ADC_D1: U9.7(IO1)
ADC_D2: U9.10(IO2)
ADC_D3: U9.11(IO3)
ADC_D4: U9.22(IO4)
ADC_D5: U9.23(IO5)
ADC_D6: U9.26(IO6)
ADC_D7: U9.27(IO7)
~{RAM_READ}: U9.28(~{OE}) ; port ~{RAM_READ}

### Buses and harness runs
bus ADC_A[0..15] = port ADC_A[0..15]
bus ADC_D[0..7] = port ADC_D[0..7]

### Notes on the sheet
- RAM Circuit

### Library data of the parts
C18 C19 = C: Capacitor; Reviewed by: RM - 2018/08/05; Revision: July-2002: Re-released for DXP Platform.; Value: 100nF; Supplier 1: *; Supplier Part Number 1: *
TP8 = Test Point: Pad; Value: Input
U9 = CY7C1019D: SRAM 128k x 8; Reviewed by: RM - 2018/08/05; Supplier 1: Digi-Key; Supplier Part Number 1: 428-1967-ND

## Sheet DSO_Trig.SchDoc: Schematic_Name
size A4; CompanyName: University of Melbourne; Engineer: Your Name Here; DocumentNumber: 1; Revision: 0.1; SheetNumber: 1; SheetTotal: 1; Title_Project: Project_Title; StudentNo: Student No.
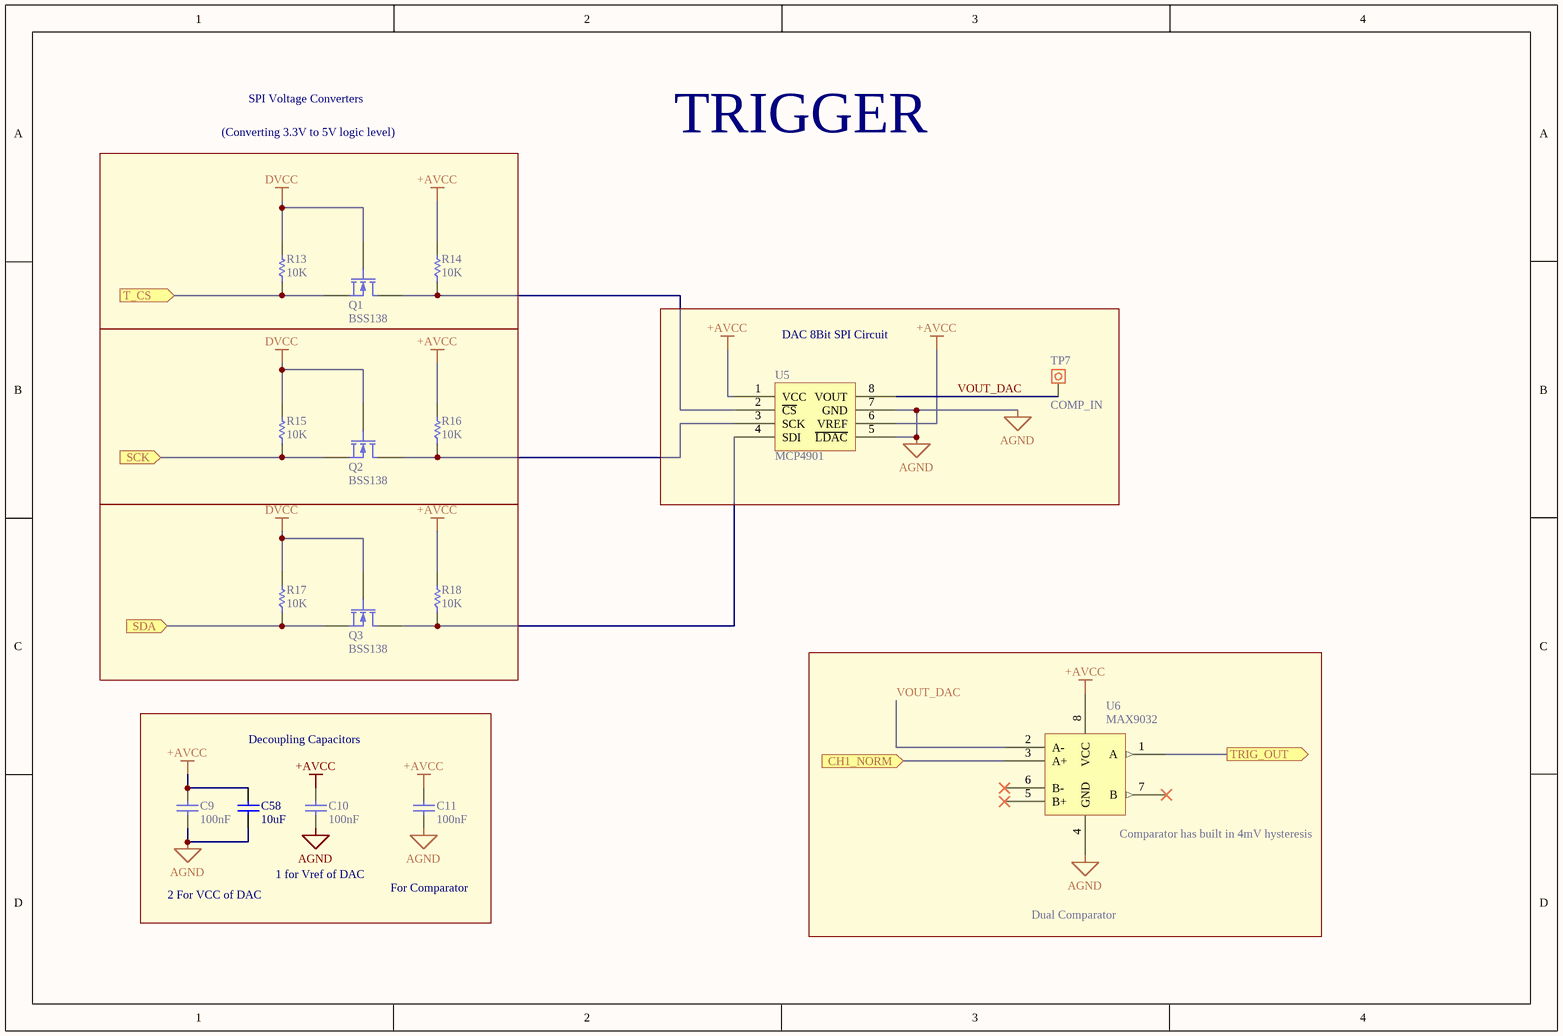
[diagram p9: DSO_Trig.SchDoc]

### Parts
C9  100nF  [0805C]
C10  100nF  [0805C]
C11  100nF  [0805C]
C58  10uF  [0805C]
Q1  BSS138  [SOT23]
Q2  BSS138  [SOT23]
Q3  BSS138  [SOT23]
R13  10K  [0805]
R14  10K  [0805]
R15  10K  [0805]
R16  10K  [0805]
R17  10K  [0805]
R18  10K  [0805]
TP7  value COMP_IN  [Testpoin]  (hidden comment: INPUT)
U5  MCP4901  [SOIC-8]
U6  MAX9032  [SOIC-8]

### Blocks framed on the sheet
(Converting 3.3V to 5V logic level): Q1 R13 R14
DAC 8Bit SPI Circuit: TP7 U5

### Ports
CH1_NORM (in), SCK (in), SDA (in), T_CS (in), TRIG_OUT (out)

### Nets
+AVCC: C9.1 C10.1 C11.1 C58.1 R14.2 R16.2 R18.2 U5.1(VCC) U5.6(VREF) U6.8(VCC)
AGND: C9.2 C10.2 C11.2 C58.2 U5.5(~{LDAC}) U5.7(GND) U6.4(GND)
DVCC: Q1.1 Q2.1 Q3.1 R13.2 R15.2 R17.2
CH1_NORM: U6.3(A+) ; port CH1_NORM
SCK: Q2.2 R15.1 ; port SCK
SDA: Q3.2 R17.1 ; port SDA
T_CS: Q1.2 R13.1 ; port T_CS
TRIG: U6.1(A) ; port TRIG_OUT
VOUT_DAC: TP7.1 U5.8(VOUT) U6.2(A-)
NetQ1_3: Q1.3 R14.1 U5.2(~{CS})
NetQ2_3: Q2.3 R16.1 U5.3(SCK)
NetQ3_3: Q3.3 R18.1 U5.4(SDI)

Not connected (* = marked no-connect by the designer): U6 5(B+)* 6(B-)* 7(B)*

### Notes on the sheet
- SPI Voltage Converters
- TRIGGER
- Decoupling Capacitors
- (near U6) Comparator has built in 4mV hysteresis
- 2 For VCC of DAC
- 1 for Vref of DAC
- For Comparator
- Dual Comparator

### Library data of the parts
C9-C11 C58 = C: Capacitor; Reviewed by: RM - 2018/08/05; Revision: July-2002: Re-released for DXP Platform.; Supplier 1: *; Supplier Part Number 1: *
  C9-C11: Value: 100nF
  C58: Value: 10uF
Q1-Q3 = MOSFET-N: N-Channel MOSFET; PackageDocument: 1995/1996; Published: 8-Jun-2000; LatestRevisionDate: 17-Jul-2002; LatestRevisionNote: Re-released for DXP Platform.; PackageReference: E3; Publisher: Altium Limited
R13-R18 = R: Resistor; Reviewed by: RM - 2018/08/05; Supplier 1: *; Suppler Part Number 1: *; Value: 10K
TP7 = Test Point: Pad
U5 = MCP4901: DAC 8bit SPI; Reviewed by: RM - 2018/08/05; Supplier 1: Digi-Key; Supplier Part Number 1: MCP4901-E/SN-ND
U6 = MAX9032: Dual Comparator; Reviewed by: RM - 2018/08/05; Supplier 1: Digi-Key; Supplier Part Number 1: MAX9032ASA-ND

## Sheet DSO_Power.SchDoc: Schematic_Name
size A4; CompanyName: University of Melbourne; Engineer: Your Name Here; DocumentNumber: 1; Revision: 0.1; SheetNumber: 1; SheetTotal: 1; Title_Project: Project_Title; StudentNo: Student No.
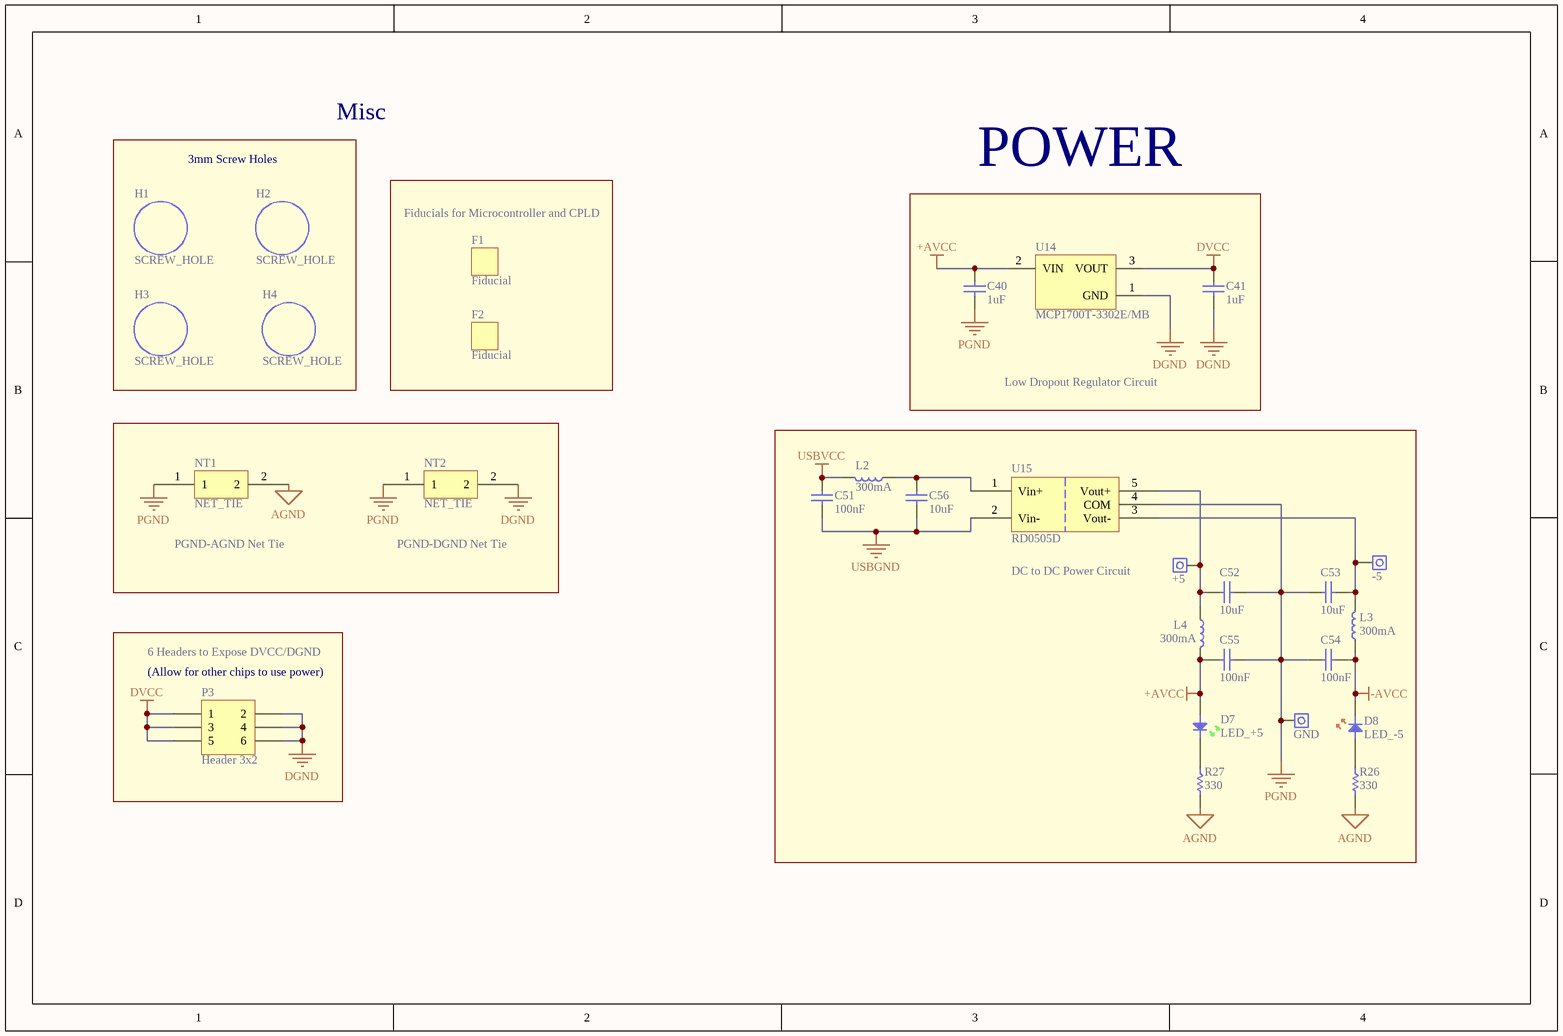
[diagram p10: DSO_Power.SchDoc]

### Parts
C40  1uF  [0805C]
C41  1uF  [0805C]
C51  100nF  [0805C]
C52  10uF  [0805C]
C53  10uF  [0805C]
C54  100nF  [0805C]
C55  100nF  [0805C]
C56  10uF  [0805C]
D7  LED_+5  [0805D-GREEN]
D8  LED_-5  [0805D-RED]
F1  Fiducial  [Fiducial]  (no BOM)
F2  Fiducial  [Fiducial]  (no BOM)
H1  SCREW_HOLE  [SCREW_HOLE]
H2  SCREW_HOLE  [SCREW_HOLE]
H3  SCREW_HOLE  [SCREW_HOLE]
H4  SCREW_HOLE  [SCREW_HOLE]
L2  300mA  [0805]
L3  300mA  [0805]
L4  300mA  [0805]
NT1  NET_TIE  [NET_TIE]  (net tie, no BOM)
NT2  NET_TIE  [NET_TIE]  (net tie, no BOM)
P3  Header 3x2  [HDR3x2]
R26  330  [0805]
R27  330  [0805]
TP9  -5  [PIN 1.8mm]
TP10  GND  [PIN 1.8mm]
TP11  +5  [PIN 1.8mm]
U14  MCP1700T-3302E/MB  [SOT89]
U15  RD0505D  [SIP_NMG]

### Blocks framed on the sheet
Misc: H1-H4
Fiducials for Microcontroller and CPLD: F1 F2
POWER: C40 C41 U14
DC to DC Power Circuit: C51-C56 D7 D8 L2-L4 R26 R27 TP9-TP11 U15

### Nets
+AVCC: C40.1 C55.1 D7.A L4.2 U14.2(VIN)
-AVCC: C54.1 D8.K L3.1
AGND: NT1.2 R26.2 R27.2
DGND: C41.2 NT2.2 P3.2 P3.4 P3.6 U14.1(GND)
DVCC: C41.1 P3.1 P3.3 P3.5 U14.3(VOUT)
PGND: C40.2 C52.2 C53.2 C54.2 C55.2 NT1.1 NT2.1 TP10.1 U15.4(COM)
USBGND: C51.2 C56.2 U15.2(Vin-)
USBVCC: C51.1 L2.2
NetC52_1: C52.1 L4.1 TP11.1 U15.5(Vout+)
NetC53_1: C53.1 L3.2 TP9.1 U15.3(Vout-)
NetC56_1: C56.1 L2.1 U15.1(Vin+)
NetD7_K: D7.K R27.1
NetD8_A: D8.A R26.1

### Notes on the sheet
- 3mm Screw Holes
- Low Dropout Regulator Circuit
- PGND-AGND Net Tie
- PGND-DGND Net Tie
- 6 Headers to Expose DVCC/DGND
- (near P3) (Allow for other chips to use power)

### Library data of the parts
C40 C41 C51-C56 = C: Capacitor; Reviewed by: RM - 2018/08/05; Revision: July-2002: Re-released for DXP Platform.; Supplier 1: *; Supplier Part Number 1: *
  C40 C41: Value: 1uF
  C51 C54 C55: Value: 100nF
  C52 C53 C56: Value: 10uF
D7 = LED GREEN: as D3 on sheet DSO_Control; Revision: July-2002: Re-released for DXP Platform.; Supplier 1: Digi-Key; Supplier Part Number 1: 160-1423-1-ND
D8 = LED RED: as D6 on sheet DSO_IO; Revision: July-2002: Re-released for DXP Platform.; Supplier 1: Digi-Key; Supplier Part Number 1: 475-1415-1-ND
L2-L4 = I: Inductor; Reviewed by: RM - 2018/08/05; Supplier 1: *; Supplier Part Number 1: *; Value: 300mA
NT1 NT2 = NET_TIE: Net Tie
P3 = Header 3x2: as P1 on sheet DSO_Control; Supplier 1: Digi-Key; Supplier Part Number 1: 952-2121-ND
R26 R27 = R: Resistor; Reviewed by: RM - 2018/08/05; Supplier 1: *; Suppler Part Number 1: *; Value: 330
TP9-TP11 = WIRE: Pad
U14 = MCP1700T: Low Quiescent Current LDO, 3-Pin SOT-89, Extended Temperature, Tape and Reel; Reviewed by: RM - 2018/08/05; Supplier 1: Digi-Key; Supplier Part Number 1: MCP1700T3302EMBCT-ND
U15 = RD0505D: (ADV) DC to DC converter 5V in +-5V out; Reviewed by: RM - 2018/08/05; Supplier Part Number 1: 945-1136-ND; Supplier 1: Digi-Key

## Nets that join several sheets
+AVCC: DSO_ADC (7 pins), DSO_Front (D1.K U1.8), DSO_Trig (10 pins), DSO_Power (5 pins)
-AVCC: DSO_ADC (C49.1 C50.1 U4.4), DSO_Front (D2.A U1.4), DSO_Power (C54.1 D8.K L3.1)
AGND: DSO_ADC (12 pins), DSO_Front (6 pins), DSO_Trig (7 pins), DSO_Power (NT1.2 R26.2 R27.2)
DGND: DSO_ADC (5 pins), DSO_Clock (C57.2 U10.3), DSO_Control (17 pins), DSO_Counters (10 pins), DSO_CPLD (27 pins), DSO_IO (C34.1), DSO_RAM (5 pins), DSO_Power (6 pins)
DVCC: DSO_ADC (C48.1 U2.20 U3.20), DSO_Clock (C57.1 R20.2 U10.2), DSO_Control (17 pins), DSO_Counters (8 pins), DSO_CPLD (7 pins), DSO_IO (C31.1 C34.2 U13.8), DSO_RAM (5 pins), DSO_Trig (6 pins), DSO_Power (5 pins)
GND: DSO_ADC (C6.2), DSO_Control (P1.6)
USBGND: DSO_IO (10 pins), DSO_Power (C51.2 C56.2 U15.2)
USBVCC: DSO_IO (9 pins), DSO_Power (C51.1 L2.2)
AA_IN: DSO_ADC (R3.2), DSO_Front (TP2.1 U1.1 U1.2)
ADC_A0: DSO_Counters (U7.15), DSO_RAM (U9.16)
ADC_A1: DSO_Counters (U7.1), DSO_RAM (U9.15)
ADC_A2: DSO_Counters (U7.2), DSO_RAM (U9.14)
ADC_A3: DSO_Counters (U7.3), DSO_RAM (U9.13)
ADC_A4: DSO_Counters (U7.4), DSO_RAM (U9.4)
ADC_A5: DSO_Counters (U7.5), DSO_RAM (U9.3)
ADC_A6: DSO_Counters (U7.6), DSO_RAM (U9.2)
ADC_A7: DSO_Counters (U7.7), DSO_RAM (U9.1)
ADC_A8: DSO_Counters (U8.15), DSO_RAM (U9.31)
ADC_A9: DSO_Counters (U8.1), DSO_RAM (U9.30)
ADC_A10: DSO_Counters (U8.2), DSO_RAM (U9.29)
ADC_A11: DSO_Counters (U8.3), DSO_RAM (U9.21)
ADC_A12: DSO_Counters (U8.4), DSO_RAM (U9.20)
ADC_A13: DSO_Counters (U8.5), DSO_RAM (U9.19)
ADC_A14: DSO_Counters (U8.6), DSO_RAM (U9.18)
ADC_A15: DSO_Counters (U8.7), DSO_RAM (U9.17)
ADC_CLK: DSO_ADC (U3.10), DSO_CPLD (U16.41), DSO_RAM (TP8.1 U9.12)
ADC_D0: DSO_ADC (U2.18), DSO_RAM (U9.6)
ADC_D1: DSO_ADC (U2.17), DSO_RAM (U9.7)
ADC_D2: DSO_ADC (U2.16), DSO_RAM (U9.10)
ADC_D3: DSO_ADC (U2.15), DSO_RAM (U9.11)
ADC_D4: DSO_ADC (U2.14), DSO_RAM (U9.22)
ADC_D5: DSO_ADC (U2.13), DSO_RAM (U9.23)
ADC_D6: DSO_ADC (U2.12), DSO_RAM (U9.26)
ADC_D7: DSO_ADC (U2.11), DSO_RAM (U9.27)
CH1_NORM: DSO_ADC (C8.1 R8.1 TP3.1 U3.17), DSO_Trig (U6.3)
CLEAR_COUNT: DSO_Counters (U7.10 U8.10), DSO_CPLD (U16.31)
COUNTER_CLK: DSO_Counters (U7.11 U7.13 U8.13), DSO_CPLD (U16.29)
EDGE_SW: DSO_Control (U11.15), DSO_CPLD (U16.5)
ENABLE: DSO_Control (U11.16), DSO_CPLD (U16.1)
ENABLE_COUNT: DSO_Counters (U7.12 U8.12), DSO_CPLD (U16.30)
FAST_CLK: DSO_Clock (U10.5), DSO_CPLD (U16.44)
FILL_COMP: DSO_Control (U11.11), DSO_CPLD (U16.28)
FORCE: DSO_Control (U11.26), DSO_CPLD (U16.2)
FULL: DSO_Counters (U8.9), DSO_CPLD (U16.7)
IN_CLK: DSO_Clock (U10.1), DSO_Control (U11.14)
PLL_S0: DSO_Clock (U10.6), DSO_Control (U11.41)
PLL_S1: DSO_Clock (U10.4), DSO_Control (U11.40)
~{RAM_READ}: DSO_CPLD (U16.6), DSO_RAM (U9.28)
RAM_READ: DSO_ADC (U2.1 U2.19), DSO_Control (U11.42), DSO_CPLD (U16.3)
RX: DSO_Control (J4.1 U11.9), DSO_IO (U13.7)
SCK: DSO_Control (J4.4 P1.3 U11.3), DSO_Trig (Q2.2 R15.1)
SDA: DSO_Control (J4.6 P1.4 U11.1), DSO_Trig (Q3.2 R17.1)
SLOW_CLK: DSO_Control (U11.13), DSO_CPLD (U16.43)
T_CS: DSO_Control (U11.43), DSO_Trig (Q1.2 R13.1)
TRIG: DSO_CPLD (U16.12), DSO_Trig (U6.1)
TX: DSO_Control (J4.2 U11.10), DSO_IO (U13.6)